# Altium schematic sheet CubeSatHeaders-OBC.SchDoc
size A4
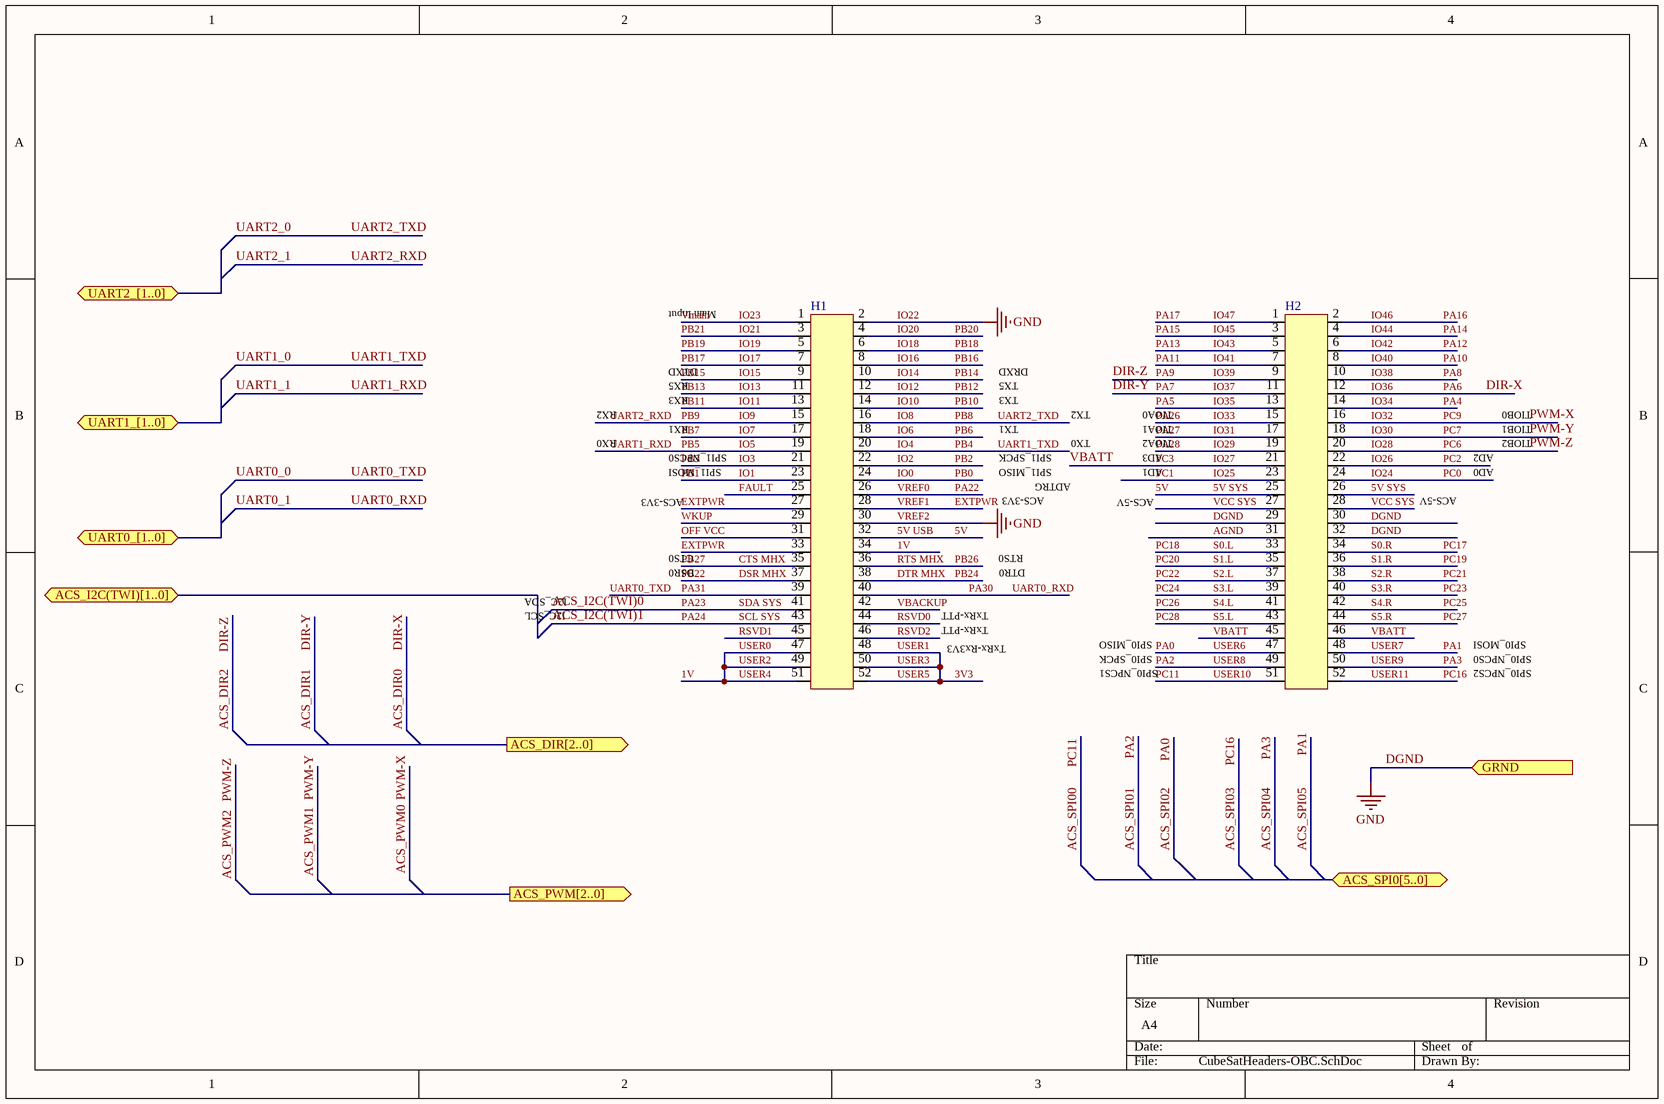
[diagram p0: CubeSatHeaders-OBC.SchDoc]

## Parts
H1  H?  [SAMTEC_ESQ_126_39_G_D]  (value not drawn)
H2  H?  [SAMTEC_ESQ_126_39_G_D]  (value not drawn)

## Ports
ACS_DIR[2..0] (out), ACS_I2C(TWI)[1..0] (bidir), ACS_PWM[2..0] (out), ACS_SPI0[5..0] (bidir), GRND (in), UART0_[1..0] (bidir), UART1_[1..0] (bidir), UART2_[1..0] (bidir)

## Nets
DGND: H1.2 H1.30 H2.29 H2.30 H2.32 ; port GRND  [also labelled GND, IO22, VREF2]
1V: H1.34 H1.47 H1.49 H1.51  [also labelled USER0, USER2, USER4]
3V3: H1.48 H1.50 H1.52  [also labelled USER1, USER3, USER5]
5V: H1.32 H2.25 H2.26  [also labelled 5V SYS, 5V USB]
ACS_DIR0: H2.12  [also labelled DIR-X, IO36, PA6]
ACS_DIR1: H2.11  [also labelled DIR-Y, IO37, PA7]
ACS_DIR2: H2.9  [also labelled DIR-Z, IO39, PA9]
ACS_I2C(TWI)0: H1.41  [also labelled PA23, SDA SYS]
ACS_I2C(TWI)1: H1.43  [also labelled PA24, SCL SYS]
ACS_PWM0: H2.16  [also labelled IO32, PC9, PWM-X]
ACS_PWM1: H2.18  [also labelled IO30, PC7, PWM-Y]
ACS_PWM2: H2.20  [also labelled IO28, PC6, PWM-Z]
ACS_SPI00: H2.51  [also labelled PC11, USER10]
ACS_SPI01: H2.49  [also labelled PA2, USER8]
ACS_SPI02: H2.47  [also labelled PA0, USER6]
ACS_SPI03: H2.52  [also labelled PC16, USER11]
ACS_SPI04: H2.50  [also labelled PA3, USER9]
ACS_SPI05: H2.48  [also labelled PA1, USER7]
AGND: H2.31
CTS MHX: H1.35  [also labelled PB27]
DSR MHX: H1.37  [also labelled PB22]
DTR MHX: H1.38  [also labelled PB24]
EXTPWR: H1.27 H1.28 H1.33  [also labelled VREF1]
FAULT: H1.25
IO0: H1.24  [also labelled PB0]
IO1: H1.23  [also labelled PB1]
IO2: H1.22  [also labelled PB2]
IO3: H1.21  [also labelled PB3]
IO4: H1.20  [also labelled PB4, UART1_0, UART1_TXD]
IO5: H1.19  [also labelled PB5, UART1_1, UART1_RXD]
IO6: H1.18  [also labelled PB6]
IO7: H1.17  [also labelled PB7]
IO8: H1.16  [also labelled PB8, UART2_0, UART2_TXD]
IO9: H1.15  [also labelled PB9, UART2_1, UART2_RXD]
IO10: H1.14  [also labelled PB10]
IO11: H1.13  [also labelled PB11]
IO12: H1.12  [also labelled PB12]
IO13: H1.11  [also labelled PB13]
IO14: H1.10  [also labelled PB14]
IO15: H1.9  [also labelled PB15]
IO16: H1.8  [also labelled PB16]
IO17: H1.7  [also labelled PB17]
IO18: H1.6  [also labelled PB18]
IO19: H1.5  [also labelled PB19]
IO20: H1.4  [also labelled PB20]
IO21: H1.3  [also labelled PB21]
IO23: H1.1  [also labelled Vmain]
IO24: H2.24  [also labelled PC0]
IO25: H2.23  [also labelled PC1]
IO26: H2.22  [also labelled PC2]
IO27: H2.21 H2.45 H2.46  [also labelled PC3, VBATT]
IO29: H2.19  [also labelled PA28]
IO31: H2.17  [also labelled PA27]
IO33: H2.15  [also labelled PA26]
IO34: H2.14  [also labelled PA4]
IO35: H2.13  [also labelled PA5]
IO38: H2.10  [also labelled PA8]
IO40: H2.8  [also labelled PA10]
IO41: H2.7  [also labelled PA11]
IO42: H2.6  [also labelled PA12]
IO43: H2.5  [also labelled PA13]
IO44: H2.4  [also labelled PA14]
IO45: H2.3  [also labelled PA15]
IO46: H2.2  [also labelled PA16]
IO47: H2.1  [also labelled PA17]
OFF VCC: H1.31
PA22: H1.26  [also labelled VREF0]
PA30: H1.40  [also labelled UART0_1, UART0_RXD]
PA31: H1.39  [also labelled UART0_0, UART0_TXD]
PB26: H1.36  [also labelled RTS MHX]
PC17: H2.34  [also labelled S0.R]
PC18: H2.33  [also labelled S0.L]
PC19: H2.36  [also labelled S1.R]
PC20: H2.35  [also labelled S1.L]
PC21: H2.38  [also labelled S2.R]
PC22: H2.37  [also labelled S2.L]
PC23: H2.40  [also labelled S3.R]
PC24: H2.39  [also labelled S3.L]
PC25: H2.42  [also labelled S4.R]
PC26: H2.41  [also labelled S4.L]
PC27: H2.44  [also labelled S5.R]
PC28: H2.43  [also labelled S5.L]
RSVD0: H1.44
RSVD1: H1.45
RSVD2: H1.46
VBACKUP: H1.42
VCC SYS: H2.27 H2.28
WKUP: H1.29

## Notes on the sheet
- Main Input
- RX3
- RX5
- DTXD
- TX3
- TX5
- DRXD
- RX0
- RX2
- RX1
- SPI1_NPCS0
- SPI1_MOSI
- TX1
- SPI1_SPCK
- SPI1_MISO
- TX0
- TX2
- AD1
- AD3
- TIOA0
- TIOA1
- TIOA2
- AD0
- AD2
- TIOB0
- TIOB1
- TIOB2
- ACS-3V3
- ADTRG
- ACS-5V
- I2C_SDA
- I2C_SCL
- CTS0
- DSR0
- TxRx-PTT
- DTR0
- RTS0
- TxRx-Rx3V3
- SPI0_MISO
- SPI0_SPCK
- SPI0_NPCS1
- SPI0_MOSI
- SPI0_NPCS0
- SPI0_NPCS2

## Library data of the parts
H1 H2 = SAMTEC_ESQ_126_39_G_D: 26X2 header